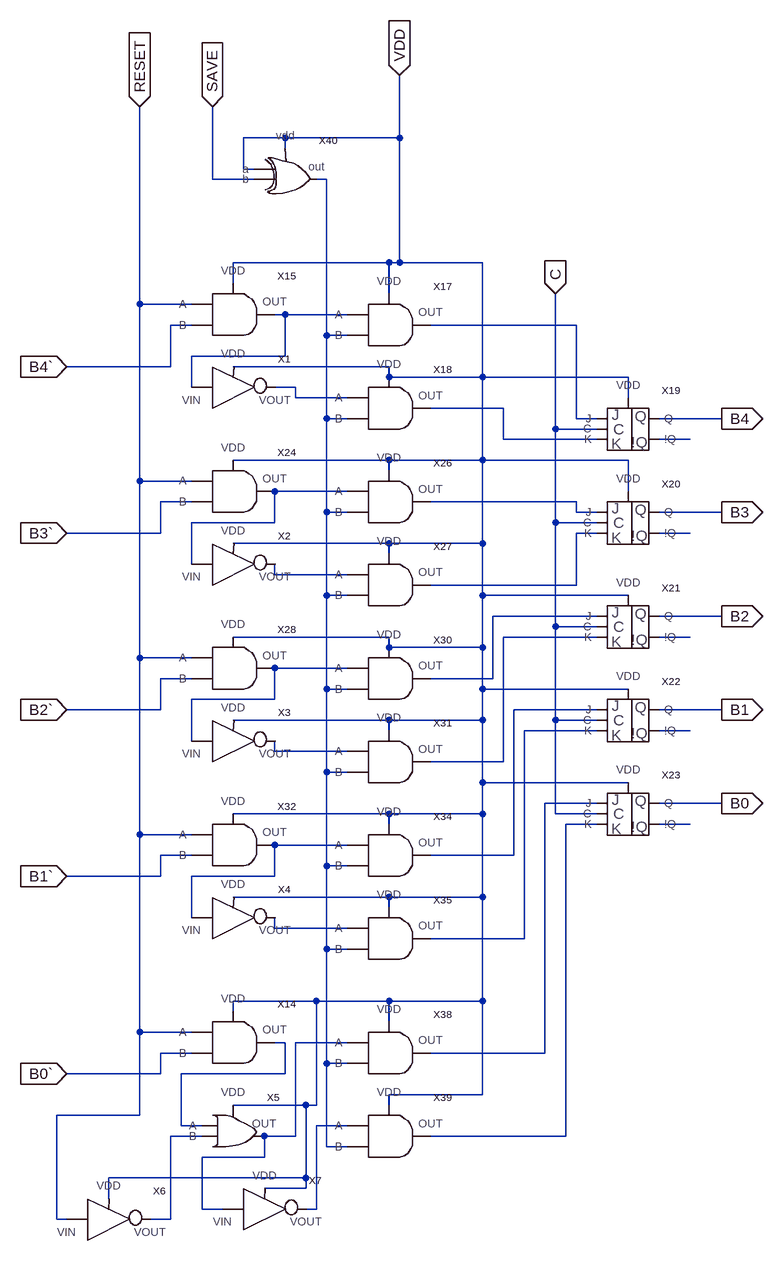
[diagram p0: schematic 4_saver.asc]
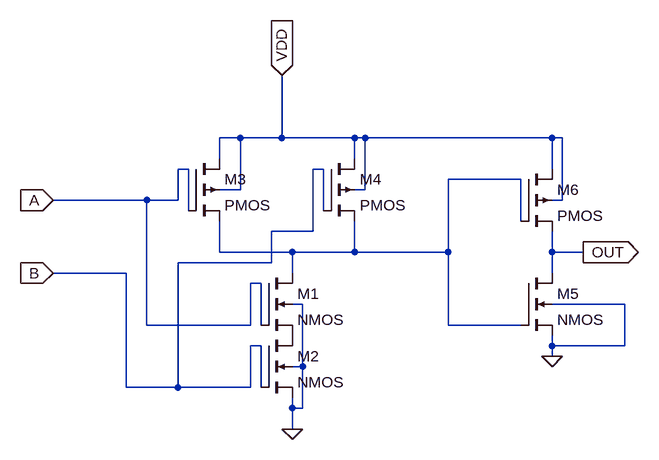
[diagram p1: sub-circuit and.asc]
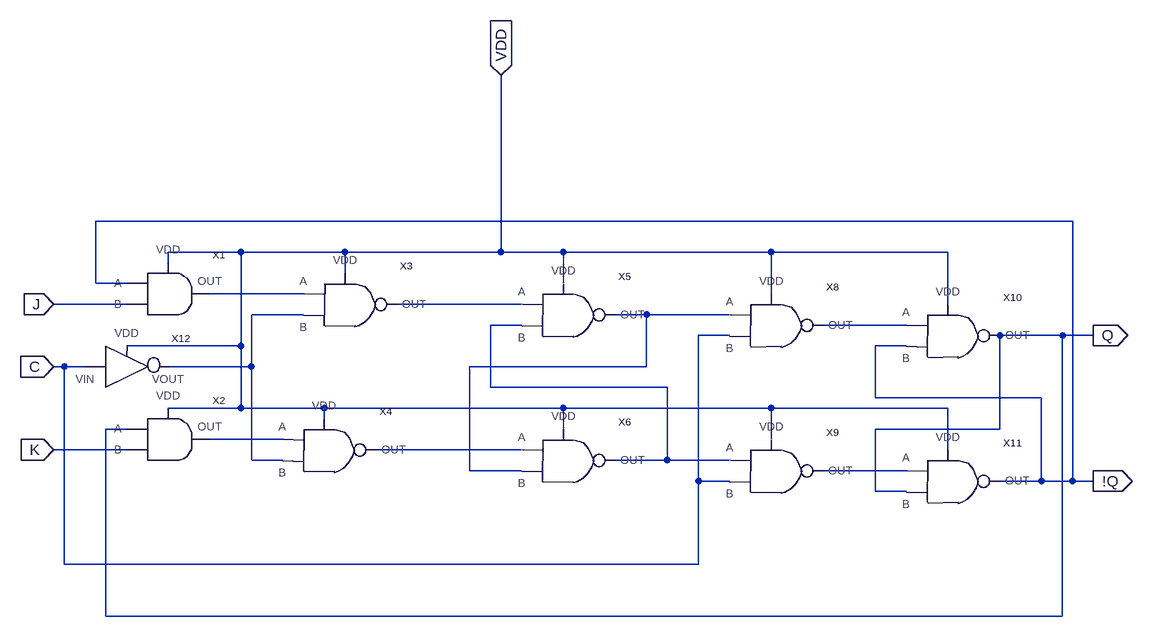
[diagram p2: sub-circuit jk-front.asc]
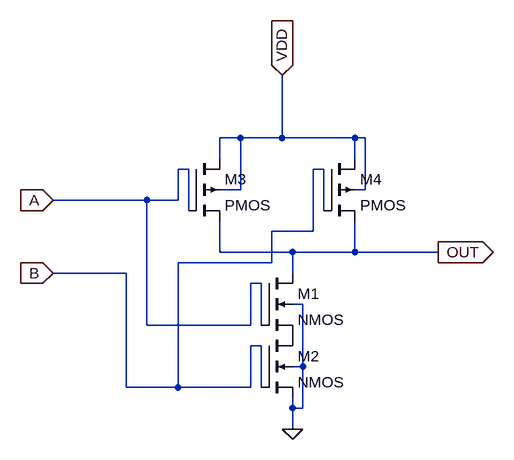
[diagram p3: sub-circuit nand.asc]
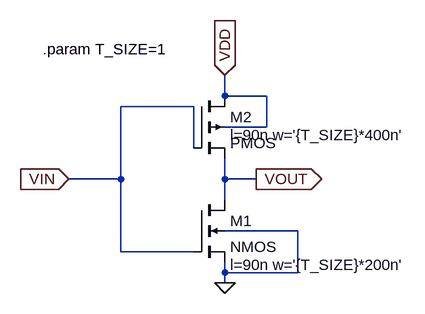
[diagram p4: sub-circuit inverter.asc]
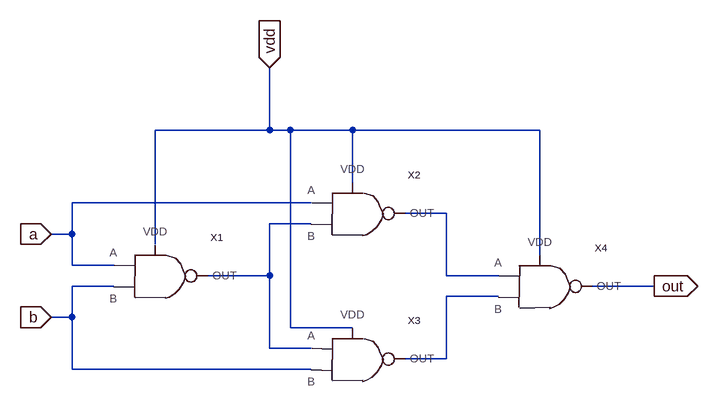
[diagram p5: sub-circuit xor.asc]
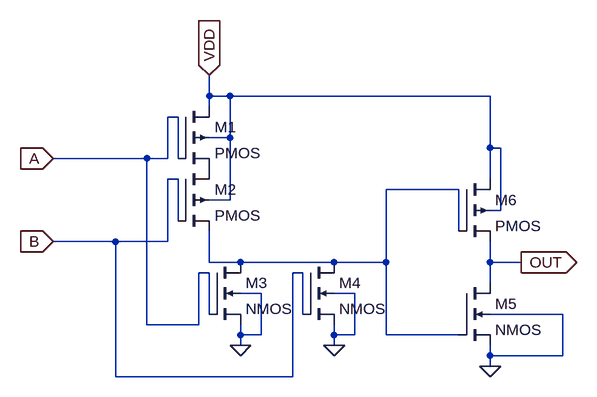
[diagram p6: sub-circuit or.asc]
4_saver.asc, the LTspice schematic file:
Version 4
SHEET 1 2252 1400
WIRE 960 -304 896 -304
WIRE 1136 -304 1136 -400
WIRE 1136 -304 960 -304
WIRE 960 -288 960 -304
WIRE 896 -256 896 -304
WIRE 912 -256 896 -256
WIRE 848 -240 848 -352
WIRE 912 -240 848 -240
WIRE 1024 -240 1008 -240
WIRE 1120 -112 880 -112
WIRE 1136 -112 1136 -304
WIRE 1136 -112 1120 -112
WIRE 1264 -112 1136 -112
WIRE 880 -80 880 -112
WIRE 1120 -64 1120 -112
WIRE 736 -48 736 -352
WIRE 816 -48 736 -48
WIRE 960 -32 944 -32
WIRE 1056 -32 960 -32
WIRE 816 -16 784 -16
WIRE 1408 -16 1184 -16
WIRE 1024 0 1024 -240
WIRE 1056 0 1024 0
WIRE 960 32 960 -32
WIRE 960 32 816 32
WIRE 784 48 784 -16
WIRE 784 48 624 48
WIRE 1120 48 880 48
WIRE 1120 64 1120 48
WIRE 1264 64 1264 -112
WIRE 1264 64 1120 64
WIRE 1488 64 1264 64
WIRE 816 80 816 32
WIRE 976 80 944 80
WIRE 976 96 976 80
WIRE 1056 96 976 96
WIRE 1488 96 1488 64
WIRE 1296 112 1184 112
WIRE 1024 128 1024 0
WIRE 1056 128 1024 128
WIRE 1408 128 1408 -16
WIRE 1440 128 1408 128
WIRE 1632 128 1536 128
WIRE 1376 144 1376 -64
WIRE 1440 144 1376 144
WIRE 1296 160 1296 112
WIRE 1440 160 1296 160
WIRE 1584 160 1536 160
WIRE 1120 192 880 192
WIRE 1264 192 1264 64
WIRE 1264 192 1120 192
WIRE 1488 192 1264 192
WIRE 1120 208 1120 192
WIRE 736 224 736 -48
WIRE 816 224 736 224
WIRE 1056 240 944 240
WIRE 1488 240 1488 192
WIRE 816 256 768 256
WIRE 1408 256 1184 256
WIRE 1024 272 1024 128
WIRE 1056 272 1024 272
WIRE 1408 272 1408 256
WIRE 1440 272 1408 272
WIRE 1632 272 1536 272
WIRE 944 288 944 240
WIRE 944 288 816 288
WIRE 1376 288 1376 144
WIRE 1440 288 1376 288
WIRE 768 304 768 256
WIRE 768 304 624 304
WIRE 1440 304 1408 304
WIRE 1584 304 1536 304
WIRE 1120 320 880 320
WIRE 1264 320 1264 192
WIRE 1264 320 1120 320
WIRE 1120 336 1120 320
WIRE 816 352 816 288
WIRE 944 368 944 352
WIRE 1056 368 944 368
WIRE 1408 384 1408 304
WIRE 1408 384 1184 384
WIRE 1024 400 1024 272
WIRE 1056 400 1024 400
WIRE 1264 400 1264 320
WIRE 1488 400 1264 400
WIRE 1440 432 1280 432
WIRE 1632 432 1536 432
WIRE 1376 448 1376 288
WIRE 1440 448 1376 448
WIRE 1120 464 880 464
WIRE 1440 464 1296 464
WIRE 1584 464 1536 464
WIRE 1120 480 1120 464
WIRE 1264 480 1264 400
WIRE 1264 480 1120 480
WIRE 736 496 736 224
WIRE 816 496 736 496
WIRE 1056 512 944 512
WIRE 816 528 768 528
WIRE 1280 528 1280 432
WIRE 1280 528 1184 528
WIRE 1024 544 1024 400
WIRE 1056 544 1024 544
WIRE 1264 544 1264 480
WIRE 1488 544 1264 544
WIRE 944 560 944 512
WIRE 944 560 816 560
WIRE 768 576 768 528
WIRE 768 576 624 576
WIRE 1440 576 1312 576
WIRE 1632 576 1536 576
WIRE 1120 592 880 592
WIRE 1264 592 1264 544
WIRE 1264 592 1120 592
WIRE 1376 592 1376 448
WIRE 1440 592 1376 592
WIRE 1120 608 1120 592
WIRE 1440 608 1328 608
WIRE 1584 608 1536 608
WIRE 816 624 816 560
WIRE 944 640 944 624
WIRE 1056 640 944 640
WIRE 1296 656 1296 464
WIRE 1296 656 1184 656
WIRE 1024 672 1024 544
WIRE 1056 672 1024 672
WIRE 1264 688 1264 592
WIRE 1488 688 1264 688
WIRE 1440 720 1360 720
WIRE 1632 720 1536 720
WIRE 1120 736 880 736
WIRE 1264 736 1264 688
WIRE 1264 736 1120 736
WIRE 1376 736 1376 592
WIRE 1440 736 1376 736
WIRE 1120 752 1120 736
WIRE 1440 752 1392 752
WIRE 1584 752 1536 752
WIRE 736 768 736 496
WIRE 816 768 736 768
WIRE 1056 784 944 784
WIRE 816 800 768 800
WIRE 1312 800 1312 576
WIRE 1312 800 1184 800
WIRE 1024 816 1024 672
WIRE 1056 816 1024 816
WIRE 768 832 768 800
WIRE 768 832 624 832
WIRE 944 832 944 784
WIRE 944 832 816 832
WIRE 1120 864 880 864
WIRE 1264 864 1264 736
WIRE 1264 864 1120 864
WIRE 1120 880 1120 864
WIRE 816 896 816 832
WIRE 944 912 944 896
WIRE 1056 912 944 912
WIRE 1328 928 1328 608
WIRE 1328 928 1184 928
WIRE 1024 944 1024 816
WIRE 1056 944 1024 944
WIRE 1008 1024 880 1024
WIRE 1120 1024 1008 1024
WIRE 1264 1024 1264 864
WIRE 1264 1024 1120 1024
WIRE 880 1040 880 1024
WIRE 1120 1056 1120 1024
WIRE 736 1072 736 768
WIRE 816 1072 736 1072
WIRE 960 1088 944 1088
WIRE 1056 1088 976 1088
WIRE 816 1104 768 1104
WIRE 1360 1104 1360 720
WIRE 1360 1104 1184 1104
WIRE 1024 1120 1024 944
WIRE 1056 1120 1024 1120
WIRE 768 1136 768 1104
WIRE 768 1136 624 1136
WIRE 960 1136 960 1088
WIRE 960 1136 800 1136
WIRE 1264 1168 1264 1024
WIRE 1264 1168 1120 1168
WIRE 992 1184 880 1184
WIRE 1008 1184 1008 1024
WIRE 1008 1184 992 1184
WIRE 1120 1184 1120 1168
WIRE 736 1200 736 1072
WIRE 736 1200 608 1200
WIRE 800 1216 800 1136
WIRE 832 1216 800 1216
WIRE 1056 1216 1008 1216
WIRE 832 1232 784 1232
WIRE 976 1232 976 1088
WIRE 976 1232 928 1232
WIRE 1392 1232 1392 752
WIRE 1392 1232 1184 1232
WIRE 1024 1248 1024 1120
WIRE 1056 1248 1024 1248
WIRE 928 1264 928 1232
WIRE 928 1264 832 1264
WIRE 992 1296 992 1184
WIRE 992 1296 688 1296
WIRE 992 1312 992 1296
WIRE 992 1312 928 1312
WIRE 688 1328 688 1296
WIRE 832 1344 832 1264
WIRE 864 1344 832 1344
WIRE 1008 1344 1008 1216
WIRE 1008 1344 992 1344
WIRE 608 1360 608 1200
WIRE 624 1360 608 1360
WIRE 784 1360 784 1232
WIRE 784 1360 752 1360
FLAG 1376 -64 C
IOPIN 1376 -64 In
FLAG 1632 128 B4
IOPIN 1632 128 Out
FLAG 1632 272 B3
IOPIN 1632 272 Out
FLAG 1632 432 B2
IOPIN 1632 432 Out
FLAG 1632 576 B1
IOPIN 1632 576 Out
FLAG 1632 720 B0
IOPIN 1632 720 Out
FLAG 848 -352 SAVE
IOPIN 848 -352 In
FLAG 736 -352 RESET
IOPIN 736 -352 In
FLAG 624 48 B4`
IOPIN 624 48 In
FLAG 624 576 B2`
IOPIN 624 576 In
FLAG 624 304 B3`
IOPIN 624 304 In
FLAG 624 832 B1`
IOPIN 624 832 In
FLAG 624 1136 B0`
IOPIN 624 1136 In
FLAG 1136 -400 VDD
IOPIN 1136 -400 In
SYMBOL and 864 -32 R0
SYMATTR InstName X15
SYMBOL and 1104 -16 R0
SYMATTR InstName X17
SYMBOL and 1104 112 R0
SYMATTR InstName X18
SYMBOL and 864 240 R0
SYMATTR InstName X24
SYMBOL and 1104 256 R0
SYMATTR InstName X26
SYMBOL and 1104 384 R0
SYMATTR InstName X27
SYMBOL and 864 512 R0
SYMATTR InstName X28
SYMBOL and 1104 528 R0
SYMATTR InstName X30
SYMBOL and 1104 656 R0
SYMATTR InstName X31
SYMBOL and 864 784 R0
SYMATTR InstName X32
SYMBOL and 1104 800 R0
SYMATTR InstName X34
SYMBOL and 1104 928 R0
SYMATTR InstName X35
SYMBOL jk-front 1488 160 R0
SYMATTR InstName X19
SYMBOL jk-front 1488 304 R0
SYMATTR InstName X20
SYMBOL jk-front 1488 464 R0
SYMATTR InstName X21
SYMBOL jk-front 1488 608 R0
SYMATTR InstName X22
SYMBOL jk-front 1488 752 R0
SYMATTR InstName X23
SYMBOL and 864 1088 R0
SYMATTR InstName X14
SYMBOL and 1104 1104 R0
SYMATTR InstName X38
SYMBOL and 1104 1232 R0
SYMATTR InstName X39
SYMBOL xor 960 -240 R0
SYMATTR InstName X40
SYMBOL inverter 880 80 R0
SYMATTR InstName X1
SYMBOL inverter 880 352 R0
SYMATTR InstName X2
SYMBOL inverter 880 624 R0
SYMATTR InstName X3
SYMBOL inverter 880 896 R0
SYMATTR InstName X4
SYMBOL or 896 1232 R0
SYMATTR InstName X5
SYMBOL inverter 688 1360 R0
SYMATTR InstName X6
SYMBOL inverter 928 1344 R0
SYMATTR InstName X7

and.asc, the sub-circuit schematic file:
Version 4
SHEET 1 1116 788
WIRE 112 -32 80 -32
WIRE 176 -32 176 -128
WIRE 176 -32 112 -32
WIRE 288 -32 176 -32
WIRE 304 -32 288 -32
WIRE 592 -32 304 -32
WIRE 608 -32 592 -32
WIRE 80 0 80 -32
WIRE 288 0 288 -32
WIRE 32 16 16 16
WIRE 240 16 224 16
WIRE 592 16 592 -32
WIRE 544 32 432 32
WIRE 112 48 112 -32
WIRE 112 48 80 48
WIRE 304 48 304 -32
WIRE 304 48 288 48
WIRE -32 64 -176 64
WIRE 16 64 16 16
WIRE 16 64 -32 64
WIRE 608 64 608 -32
WIRE 608 64 592 64
WIRE 32 80 32 16
WIRE 240 80 240 16
WIRE 544 96 544 32
WIRE 224 112 224 16
WIRE 224 112 160 112
WIRE 80 144 80 96
WIRE 192 144 80 144
WIRE 288 144 288 96
WIRE 288 144 192 144
WIRE 432 144 432 32
WIRE 432 144 288 144
WIRE 592 144 592 112
WIRE 640 144 592 144
WIRE 160 160 160 112
WIRE 160 160 16 160
WIRE -64 176 -176 176
WIRE 192 176 192 144
WIRE 592 176 592 144
WIRE 144 192 128 192
WIRE 208 224 192 224
WIRE 704 224 592 224
WIRE -32 256 -32 64
WIRE 128 256 128 192
WIRE 128 256 -32 256
WIRE 144 256 144 192
WIRE 432 256 432 144
WIRE 544 256 432 256
WIRE 144 288 128 288
WIRE 592 288 592 272
WIRE 704 288 704 224
WIRE 704 288 592 288
WIRE 592 304 592 288
WIRE 208 320 208 224
WIRE 208 320 192 320
WIRE -64 352 -64 176
WIRE 16 352 16 160
WIRE 16 352 -64 352
WIRE 128 352 128 288
WIRE 128 352 16 352
WIRE 144 352 144 288
WIRE 192 384 192 368
WIRE 208 384 208 320
WIRE 208 384 192 384
WIRE 192 416 192 384
FLAG 192 416 0
FLAG -176 64 A
IOPIN -176 64 In
FLAG -176 176 B
IOPIN -176 176 In
FLAG 176 -128 VDD
IOPIN 176 -128 In
FLAG 592 304 0
FLAG 640 144 OUT
IOPIN 640 144 Out
SYMBOL nmos4 144 176 R0
SYMATTR InstName M1
SYMATTR Value2 l=90n w=200n
SYMBOL nmos4 144 272 R0
SYMATTR InstName M2
SYMATTR Value2 l=90n w=200n
SYMBOL pmos4 32 0 R0
SYMATTR InstName M3
SYMATTR Value2 l=90n w=400n
SYMBOL pmos4 240 0 R0
SYMATTR InstName M4
SYMATTR Value2 l=90n w=400n
SYMBOL nmos4 544 176 R0
SYMATTR Value2 l=90n w=200n
SYMATTR InstName M5
SYMBOL pmos4 544 16 R0
SYMATTR Value2 l=90n w=400n
SYMATTR InstName M6

jk-front.asc, the sub-circuit schematic file:
Version 4
SHEET 1 1588 680
WIRE 1472 -48 -32 -48
WIRE 192 0 80 0
WIRE 352 0 192 0
WIRE 592 0 592 -272
WIRE 592 0 352 0
WIRE 688 0 592 0
WIRE 1008 0 688 0
WIRE 1280 0 1008 0
WIRE 80 16 80 0
WIRE 352 32 352 0
WIRE -32 48 -32 -48
WIRE 16 48 -32 48
WIRE 688 48 688 0
WIRE 288 64 144 64
WIRE 1008 64 1008 0
WIRE 16 80 -96 80
WIRE 624 80 432 80
WIRE 1280 80 1280 0
WIRE 288 96 208 96
WIRE 816 96 768 96
WIRE 944 96 816 96
WIRE 624 112 576 112
WIRE 1216 112 1088 112
WIRE 944 128 896 128
WIRE 1456 128 1360 128
WIRE 1504 128 1456 128
WIRE 192 144 192 0
WIRE 192 144 16 144
WIRE 1216 144 1168 144
WIRE -80 176 -96 176
WIRE -48 176 -80 176
WIRE 208 176 208 96
WIRE 208 176 80 176
WIRE 816 176 816 96
WIRE 816 176 544 176
WIRE 576 208 576 112
WIRE 848 208 576 208
WIRE 1168 224 1168 144
WIRE 1424 224 1168 224
WIRE 192 240 192 144
WIRE 192 240 80 240
WIRE 320 240 192 240
WIRE 688 240 320 240
WIRE 1008 240 688 240
WIRE 1280 240 1008 240
WIRE 320 256 320 240
WIRE 16 272 -16 272
WIRE 688 272 688 240
WIRE 1360 272 1360 128
WIRE 1360 272 1168 272
WIRE 256 288 144 288
WIRE 1008 288 1008 240
WIRE 16 304 -96 304
WIRE 624 304 400 304
WIRE 1280 304 1280 240
WIRE 208 320 208 176
WIRE 256 320 208 320
WIRE 848 320 848 208
WIRE 848 320 768 320
WIRE 944 320 848 320
WIRE 544 336 544 176
WIRE 624 336 544 336
WIRE 1216 336 1088 336
WIRE 896 352 896 128
WIRE 944 352 896 352
WIRE 1424 352 1424 224
WIRE 1424 352 1360 352
WIRE 1472 352 1472 -48
WIRE 1472 352 1424 352
WIRE 1504 352 1472 352
WIRE 1168 368 1168 272
WIRE 1216 368 1168 368
WIRE -80 480 -80 176
WIRE 896 480 896 352
WIRE 896 480 -80 480
WIRE -16 560 -16 272
WIRE 1456 560 1456 128
WIRE 1456 560 -16 560
FLAG -96 80 J
IOPIN -96 80 In
FLAG -96 176 C
IOPIN -96 176 In
FLAG -96 304 K
IOPIN -96 304 In
FLAG 1504 128 Q
IOPIN 1504 128 Out
FLAG 1504 352 !Q
IOPIN 1504 352 Out
FLAG 592 -272 VDD
IOPIN 592 -272 In
SYMBOL and 64 64 R0
SYMATTR InstName X1
SYMBOL and 64 288 R0
SYMATTR InstName X2
SYMBOL nand 352 80 R0
SYMATTR InstName X3
SYMBOL nand 320 304 R0
SYMATTR InstName X4
SYMBOL nand 688 96 R0
SYMATTR InstName X5
SYMBOL nand 688 320 R0
SYMATTR InstName X6
SYMBOL nand 1008 112 R0
SYMATTR InstName X8
SYMBOL nand 1008 336 R0
SYMATTR InstName X9
SYMBOL nand 1280 128 R0
SYMATTR InstName X10
SYMBOL nand 1280 352 R0
SYMATTR InstName X11
SYMBOL inverter 16 176 R0
SYMATTR InstName X12

nand.asc, the sub-circuit schematic file:
Version 4
SHEET 1 880 680
WIRE 144 -80 112 -80
WIRE 208 -80 208 -176
WIRE 208 -80 144 -80
WIRE 320 -80 208 -80
WIRE 336 -80 320 -80
WIRE 112 -48 112 -80
WIRE 320 -48 320 -80
WIRE 64 -32 48 -32
WIRE 272 -32 256 -32
WIRE 144 0 144 -80
WIRE 144 0 112 0
WIRE 336 0 336 -80
WIRE 336 0 320 0
WIRE 0 16 -144 16
WIRE 48 16 48 -32
WIRE 48 16 0 16
WIRE 64 32 64 -32
WIRE 272 32 272 -32
WIRE 256 64 256 -32
WIRE 256 64 192 64
WIRE 112 96 112 48
WIRE 224 96 112 96
WIRE 320 96 320 48
WIRE 320 96 224 96
WIRE 448 96 320 96
WIRE 192 112 192 64
WIRE 192 112 48 112
WIRE -32 128 -144 128
WIRE 224 128 224 96
WIRE 176 144 160 144
WIRE 240 176 224 176
WIRE 0 208 0 16
WIRE 160 208 160 144
WIRE 160 208 0 208
WIRE 176 208 176 144
WIRE 176 240 160 240
WIRE 240 272 240 176
WIRE 240 272 224 272
WIRE -32 304 -32 128
WIRE 48 304 48 112
WIRE 48 304 -32 304
WIRE 160 304 160 240
WIRE 160 304 48 304
WIRE 176 304 176 240
WIRE 224 336 224 320
WIRE 240 336 240 272
WIRE 240 336 224 336
WIRE 224 368 224 336
FLAG 224 368 0
FLAG 448 96 OUT
IOPIN 448 96 Out
FLAG -144 16 A
IOPIN -144 16 In
FLAG -144 128 B
IOPIN -144 128 In
FLAG 208 -176 VDD
IOPIN 208 -176 In
SYMBOL nmos4 176 128 R0
SYMATTR InstName M1
SYMATTR Value2 l=90n w=200n
SYMBOL nmos4 176 224 R0
SYMATTR InstName M2
SYMATTR Value2 l=90n w=200n
SYMBOL pmos4 64 -48 R0
SYMATTR InstName M3
SYMATTR Value2 l=90n w=400n
SYMBOL pmos4 272 -48 R0
SYMATTR InstName M4
SYMATTR Value2 l=90n w=400n

inverter.asc, the sub-circuit schematic file:
Version 4
SHEET 1 880 680
WIRE 176 -128 176 -160
WIRE 240 -128 176 -128
WIRE 128 -112 16 -112
WIRE 240 -80 240 -128
WIRE 240 -80 176 -80
WIRE 128 -48 128 -112
WIRE 16 0 16 -112
WIRE 16 0 -64 0
WIRE 176 0 176 -32
WIRE 224 0 176 0
WIRE 176 32 176 0
WIRE 288 80 176 80
WIRE 16 112 16 0
WIRE 128 112 16 112
WIRE 176 144 176 128
WIRE 288 144 288 80
WIRE 288 144 176 144
WIRE 176 160 176 144
FLAG 176 160 0
FLAG -64 0 VIN
IOPIN -64 0 In
FLAG 224 0 VOUT
IOPIN 224 0 Out
FLAG 176 -160 VDD
IOPIN 176 -160 In
SYMBOL nmos4 128 32 R0
WINDOW 123 56 100 Left 2
SYMATTR InstName M1
SYMATTR Value2 l=90n w='{T_SIZE}*200n'
SYMBOL pmos4 128 -128 R0
WINDOW 123 56 60 Left 2
SYMATTR InstName M2
SYMATTR Value2 l=90n w='{T_SIZE}*400n'
TEXT -104 -200 Left 2 !.param T_SIZE=1

xor.asc, the sub-circuit schematic file:
Version 4
SHEET 1 1104 680
WIRE 416 -112 416 -208
WIRE 416 -112 240 -112
WIRE 448 -112 416 -112
WIRE 544 -112 448 -112
WIRE 832 -112 544 -112
WIRE 544 -32 544 -112
WIRE 480 0 112 0
WIRE 688 16 624 16
WIRE 480 32 416 32
WIRE 112 48 112 0
WIRE 112 48 80 48
WIRE 240 64 240 -112
WIRE 832 80 832 -112
WIRE 112 96 112 48
WIRE 176 96 112 96
WIRE 416 112 416 32
WIRE 416 112 320 112
WIRE 688 112 688 16
WIRE 768 112 688 112
WIRE 176 128 112 128
WIRE 1008 128 912 128
WIRE 768 144 688 144
WIRE 112 176 112 128
WIRE 112 176 80 176
WIRE 448 192 448 -112
WIRE 544 192 448 192
WIRE 416 224 416 112
WIRE 480 224 416 224
WIRE 688 240 688 144
WIRE 688 240 624 240
WIRE 112 256 112 176
WIRE 480 256 112 256
FLAG 80 48 a
IOPIN 80 48 In
FLAG 80 176 b
IOPIN 80 176 In
FLAG 1008 128 out
IOPIN 1008 128 Out
FLAG 416 -208 vdd
IOPIN 416 -208 In
SYMBOL nand 240 112 R0
SYMATTR InstName X1
SYMBOL nand 544 16 R0
SYMATTR InstName X2
SYMBOL nand 544 240 R0
SYMATTR InstName X3
SYMBOL nand 832 128 R0
SYMATTR InstName X4

or.asc, the sub-circuit schematic file:
Version 4
SHEET 1 1084 680
WIRE 32 -32 32 -64
WIRE 64 -32 32 -32
WIRE 464 -32 64 -32
WIRE 32 -16 32 -32
WIRE -16 0 -32 0
WIRE 64 32 64 -32
WIRE 64 32 32 32
WIRE 464 48 464 -32
WIRE 480 48 464 48
WIRE -64 64 -208 64
WIRE -32 64 -32 0
WIRE -32 64 -64 64
WIRE -16 64 -16 0
WIRE -16 96 -32 96
WIRE 464 96 464 48
WIRE 416 112 304 112
WIRE 64 128 64 32
WIRE 64 128 32 128
WIRE 480 144 480 48
WIRE 480 144 464 144
WIRE -16 160 -16 96
WIRE 416 176 416 112
WIRE -112 192 -208 192
WIRE -32 192 -32 96
WIRE -32 192 -112 192
WIRE 32 224 32 176
WIRE 80 224 32 224
WIRE 224 224 80 224
WIRE 304 224 304 112
WIRE 304 224 224 224
WIRE 464 224 464 192
WIRE 512 224 464 224
WIRE 32 240 16 240
WIRE 176 240 160 240
WIRE 464 256 464 224
WIRE 112 272 80 272
WIRE 256 272 224 272
WIRE 32 304 32 240
WIRE 176 304 176 240
WIRE 576 304 464 304
WIRE -64 320 -64 64
WIRE 16 320 16 240
WIRE 16 320 -64 320
WIRE 80 336 80 320
WIRE 112 336 112 272
WIRE 112 336 80 336
WIRE 224 336 224 320
WIRE 256 336 256 272
WIRE 256 336 224 336
WIRE 304 336 304 224
WIRE 416 336 304 336
WIRE 80 352 80 336
WIRE 224 352 224 336
WIRE 464 368 464 352
WIRE 576 368 576 304
WIRE 576 368 464 368
WIRE 464 384 464 368
WIRE -112 400 -112 192
WIRE 160 400 160 240
WIRE 160 400 -112 400
FLAG 32 -64 VDD
IOPIN 32 -64 In
FLAG 80 352 0
FLAG 224 352 0
FLAG -208 64 A
IOPIN -208 64 In
FLAG -208 192 B
IOPIN -208 192 In
FLAG 464 384 0
FLAG 512 224 OUT
IOPIN 512 224 Out
SYMBOL pmos4 -16 -16 R0
SYMATTR InstName M1
SYMATTR Value2 l=90n w=400n
SYMBOL pmos4 -16 80 R0
SYMATTR InstName M2
SYMATTR Value2 l=90n w=400n
SYMBOL nmos4 32 224 R0
SYMATTR InstName M3
SYMATTR Value2 l=90n w=200n
SYMBOL nmos4 176 224 R0
SYMATTR InstName M4
SYMATTR Value2 l=90n w=200n
SYMBOL nmos4 416 256 R0
SYMATTR Value2 l=90n w=200n
SYMATTR InstName M5
SYMBOL pmos4 416 96 R0
SYMATTR Value2 l=90n w=400n
SYMATTR InstName M6

The netlist it stands for:
* 4_saver.asc
XX15 VDD RESET B4` N002 and
XX17 VDD N002 N001 N003 and
XX18 VDD N004 N001 N005 and
XX24 VDD RESET B3` N007 and
XX26 VDD N007 N001 N008 and
XX27 VDD N011 N001 N009 and
XX28 VDD RESET B2` N015 and
XX30 VDD N015 N001 N012 and
XX31 VDD N019 N001 N013 and
XX32 VDD RESET B1` N023 and
XX34 VDD N023 N001 N016 and
XX35 VDD N024 N001 N017 and
XX19 N003 C N005 VDD B4 N006 jk-front
XX20 N008 C N009 VDD B3 N010 jk-front
XX21 N012 C N013 VDD B2 N014 jk-front
XX22 N016 C N017 VDD B1 N018 jk-front
XX23 N020 C N021 VDD B0 N022 jk-front
XX14 VDD RESET B0` N025 and
XX38 VDD N026 N001 N020 and
XX39 VDD N027 N001 N021 and
XX40 VDD SAVE VDD N001 xor
XX1 N002 VDD N004 inverter
XX2 N007 VDD N011 inverter
XX3 N015 VDD N019 inverter
XX4 N023 VDD N024 inverter
XX5 N025 N028 VDD N026 or
XX6 RESET VDD N028 inverter
XX7 N026 VDD N027 inverter

* block symbol definitions
.subckt and VDD A B OUT
M1 N001 A P001 0 NMOS l=90n w=200n
M2 P001 B 0 0 NMOS l=90n w=200n
M3 VDD A N001 VDD PMOS l=90n w=400n
M4 VDD B N001 VDD PMOS l=90n w=400n
M5 OUT N001 0 0 NMOS l=90n w=200n
M6 VDD N001 OUT VDD PMOS l=90n w=400n
.ends and

.subckt jk-front J C K VDD Q !Q
XX1 VDD !Q J N001 and
XX2 VDD Q K N007 and
XX3 N001 N003 N002 VDD nand
XX4 N007 N003 N008 VDD nand
XX5 N002 N005 N004 VDD nand
XX6 N008 N004 N005 VDD nand
XX8 N004 C N006 VDD nand
XX9 N005 C N009 VDD nand
XX10 N006 !Q Q VDD nand
XX11 N009 Q !Q VDD nand
XX12 C VDD N003 inverter
.ends jk-front

.subckt nand A B OUT VDD
M1 OUT A P001 0 NMOS l=90n w=200n
M2 P001 B 0 0 NMOS l=90n w=200n
M3 VDD A OUT VDD PMOS l=90n w=400n
M4 VDD B OUT VDD PMOS l=90n w=400n
.ends nand

.subckt inverter VIN VDD VOUT
M1 VOUT VIN 0 0 NMOS l=90n w='{T_SIZE}*200n'
M2 VDD VIN VOUT VDD PMOS l=90n w='{T_SIZE}*400n'
.param T_SIZE=1
.ends inverter

.subckt xor a b vdd out
XX1 a b N002 vdd nand
XX2 a N002 N001 vdd nand
XX3 N002 b N003 vdd nand
XX4 N001 N003 out vdd nand
.ends xor

.subckt or A B VDD OUT
M1 VDD A P001 VDD PMOS l=90n w=400n
M2 P001 B N001 VDD PMOS l=90n w=400n
M3 N001 A 0 0 NMOS l=90n w=200n
M4 N001 B 0 0 NMOS l=90n w=200n
M5 OUT N001 0 0 NMOS l=90n w=200n
M6 VDD N001 OUT VDD PMOS l=90n w=400n
.ends or

.model NMOS NMOS
.model PMOS PMOS
.lib standard.mos
.backanno
.end